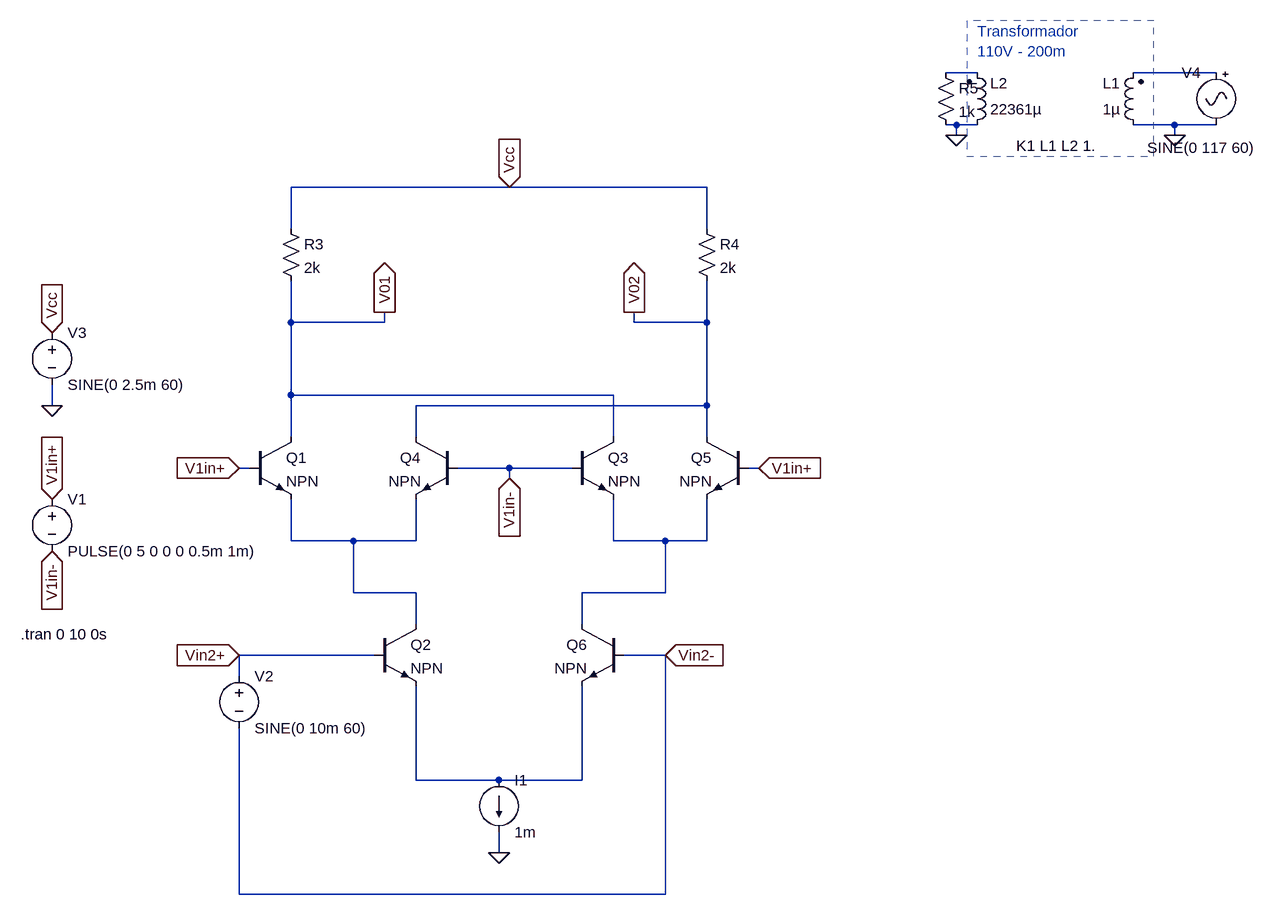
[diagram p0: schematic Medidor de Energia modulador.asc]
Medidor de Energia modulador.asc, the LTspice schematic file:
Version 4
SHEET 1 1840 776
WIRE 1408 -512 1360 -512
WIRE 1776 -512 1648 -512
WIRE 1376 -432 1360 -432
WIRE 1408 -432 1376 -432
WIRE 1712 -432 1648 -432
WIRE 1776 -432 1712 -432
WIRE 1376 -416 1376 -432
WIRE 1712 -416 1712 -432
WIRE 688 -336 352 -336
WIRE 992 -336 688 -336
WIRE 352 -272 352 -336
WIRE 992 -272 992 -336
WIRE 352 -128 352 -192
WIRE 496 -128 496 -144
WIRE 496 -128 352 -128
WIRE 880 -128 880 -144
WIRE 992 -128 992 -192
WIRE 992 -128 880 -128
WIRE 352 -16 352 -128
WIRE 848 -16 352 -16
WIRE -16 0 -16 -32
WIRE 992 0 992 -128
WIRE 992 0 544 0
WIRE 352 48 352 -16
WIRE 544 48 544 0
WIRE 848 48 848 -16
WIRE 992 48 992 0
WIRE 288 96 272 96
WIRE 688 96 608 96
WIRE 784 96 688 96
WIRE 1072 96 1056 96
WIRE 688 112 688 96
WIRE 352 208 352 144
WIRE 448 208 352 208
WIRE 544 208 544 144
WIRE 544 208 448 208
WIRE 848 208 848 144
WIRE 928 208 848 208
WIRE 992 208 992 144
WIRE 992 208 928 208
WIRE 448 288 448 208
WIRE 544 288 448 288
WIRE 928 288 928 208
WIRE 928 288 800 288
WIRE 544 336 544 288
WIRE 800 336 800 288
WIRE 480 384 272 384
WIRE 928 384 864 384
WIRE 272 416 272 384
WIRE 544 576 544 432
WIRE 672 576 544 576
WIRE 800 576 800 432
WIRE 800 576 672 576
WIRE 672 688 672 656
WIRE 272 752 272 496
WIRE 928 752 928 384
WIRE 928 752 272 752
FLAG 672 688 0
FLAG 688 112 V1in-
IOPIN 688 112 In
FLAG 272 96 V1in+
IOPIN 272 96 In
FLAG 1072 96 V1in+
IOPIN 1072 96 In
FLAG -16 224 V1in-
IOPIN -16 224 In
FLAG -16 144 V1in+
IOPIN -16 144 In
FLAG 688 -336 Vcc
IOPIN 688 -336 In
FLAG -16 -112 Vcc
IOPIN -16 -112 In
FLAG -16 0 0
FLAG 272 384 Vin2+
IOPIN 272 384 In
FLAG 928 384 Vin2-
IOPIN 928 384 In
FLAG 496 -144 V01
IOPIN 496 -144 Out
FLAG 880 -144 V02
IOPIN 880 -144 Out
FLAG 1712 -416 0
FLAG 1376 -416 0
SYMBOL voltage -16 128 R0
WINDOW 123 0 0 Left 2
WINDOW 39 0 0 Left 2
SYMATTR InstName V1
SYMATTR Value PULSE(0 5 0 0 0 0.5m 1m)
SYMBOL voltage 272 400 R0
WINDOW 123 0 0 Left 2
WINDOW 39 0 0 Left 2
SYMATTR InstName V2
SYMATTR Value SINE(0 10m 60)
SYMBOL npn 288 48 R0
SYMATTR InstName Q1
SYMBOL npn 480 336 R0
SYMATTR InstName Q2
SYMBOL npn 784 48 R0
SYMATTR InstName Q3
SYMBOL npn 608 48 M0
SYMATTR InstName Q4
SYMBOL npn 1056 48 M0
SYMATTR InstName Q5
SYMBOL npn 864 336 M0
SYMATTR InstName Q6
SYMBOL current 672 576 R0
WINDOW 123 0 0 Left 2
WINDOW 39 0 0 Left 2
SYMATTR InstName I1
SYMATTR Value 1m
SYMBOL voltage -16 -128 R0
WINDOW 123 0 0 Left 2
WINDOW 39 0 0 Left 2
SYMATTR InstName V3
SYMATTR Value SINE(0 2.5m 60)
SYMBOL res 336 -288 R0
SYMATTR InstName R3
SYMATTR Value 2k
SYMBOL res 976 -288 R0
SYMATTR InstName R4
SYMATTR Value 2k
SYMBOL ind2 1664 -416 R180
WINDOW 0 36 80 Left 2
WINDOW 3 36 40 Left 2
SYMATTR InstName L1
SYMATTR Value 1µ
SYMATTR SpiceLine Rser=100
SYMBOL ind2 1392 -416 M180
WINDOW 0 36 80 Left 2
WINDOW 3 36 40 Left 2
SYMATTR InstName L2
SYMATTR Value 22361µ
SYMATTR SpiceLine Rser=100
SYMBOL Misc\\signal 1776 -528 M0
WINDOW 3 -60 131 Left 2
WINDOW 123 0 0 Left 2
WINDOW 39 0 0 Left 2
SYMATTR Value SINE(0 117 60)
SYMATTR InstName V4
SYMBOL res 1344 -528 R0
SYMATTR InstName R5
SYMATTR Value 1k
TEXT 1592 -400 Right 2 !K1 L1 L2 1.
TEXT 1408 -576 Left 2 ;Transformador \n110V - 200m
TEXT -64 352 Left 2 !.tran 0 10 0s
LINE Normal 1680 -384 1680 -592 2
LINE Normal 1392 -384 1680 -384 2
LINE Normal 1392 -592 1392 -384 2
LINE Normal 1680 -592 1392 -592 2

The netlist it stands for:
* Medidor de Energia modulador.asc
V1 V1in+ V1in- PULSE(0 5 0 0 0 0.5m 1m)
V2 Vin2+ Vin2- SINE(0 10m 60)
Q1 V01 V1in+ N003 0 NPN
Q2 N003 Vin2+ N005 0 NPN
Q3 V01 V1in- N004 0 NPN
Q4 V02 V1in- N003 0 NPN
Q5 V02 V1in+ N004 0 NPN
Q6 N004 Vin2- N005 0 NPN
I1 N005 0 1m
V3 Vcc 0 SINE(0 2.5m 60)
R3 Vcc V01 2k
R4 Vcc V02 2k
L1 0 N002 1µ Rser=100
L2 0 N001 22361µ Rser=100
V4 N002 0 SINE(0 117 60)
R5 N001 0 1k
.model NPN NPN
.model PNP PNP
.lib standard.bjt
K1 L1 L2 1.
* Transformador
* 110V - 200m
.tran 0 10 0s
.backanno
.end